# Altium schematic sheet MODELO TRANSFORMADOR.SCHDOC
size A
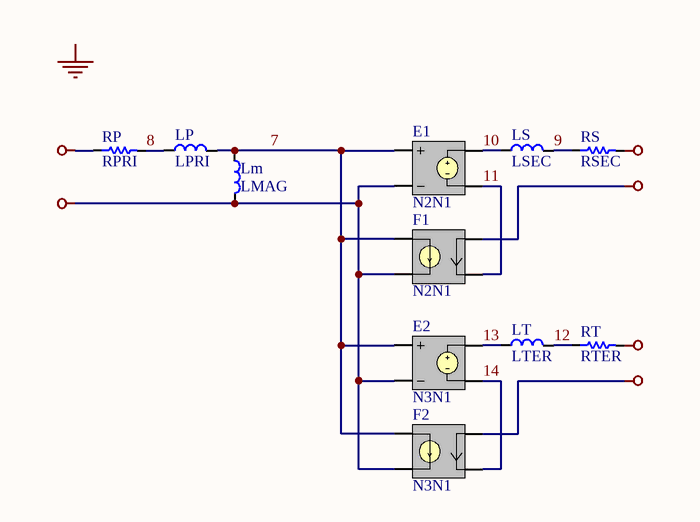
[diagram p0: MODELO TRANSFORMADOR.SCHDOC]

## Parts
E1  Gain: N2N1  (hidden comment: ESRC)
E2  Gain: N3N1  (hidden comment: ESRC)
F1  Gain: N2N1  (hidden comment: FSRC)
F2  Gain: N3N1  (hidden comment: FSRC)
Lm  value LMAG  [TOROIDE TN14-9-5]  (hidden comment: Inductor2)
LP  value LPRI  [TOROIDE TN14-9-5]  (hidden comment: Inductor2)
LS  value LSEC  [TOROIDE TN14-9-5]  (hidden comment: Inductor2)
LT  value LTER  [TOROIDE TN14-9-5]  (hidden comment: Inductor2)
RP  value RPRI  [0805]  (hidden comment: Res)
RS  value RSEC  [0805]  (hidden comment: Res)
RT  value RTER  [0805]  (hidden comment: Res)

## Nets
1: RP.1
2: E1.2(NC-) E2.2(NC-) F1.4(N-) F2.4(N-) Lm.2
3: RS.2
4: F1.1(NC+)
5: RT.2
6: F2.1(NC+)
7: E1.1(NC+) E2.1(NC+) F1.3(N+) F2.3(N+) Lm.1 LP.2
8: LP.1 RP.2
9: LS.2 RS.1
10: E1.3(N+) LS.1
11: E1.4(N-) F1.2(NC-)
12: LT.2 RT.1
13: E2.3(N+) LT.1
14: E2.4(N-) F2.2(NC-)

## Notes on the sheet
- Labels drawn without touching a wire or pin: GND

## Library data of the parts
E1 E2 = ESRC: Voltage Controlled Voltage Source; Note: PCB Footprint - Not required; Published: 8-Jun-2000; Revision: 17-Jul-2002: Re-released for DXP Platform.; Package Reference: Not Applicable; Publisher: Altium Limited
F1 F2 = FSRC: Current Controlled Current Source; Note: PCB Footprint - Not required; Published: 8-Jun-2000; Revision: 17-Jul-2002: Re-released for DXP Platform.; Package Reference: Not Applicable; Publisher: Altium Limited
Lm LP LS LT = Inductor2: Inductor; Revision: July-2002: Re-released for DXP Platform.
RP RS RT = Res: Resistor; Power: 0.25W; Price: 0.036